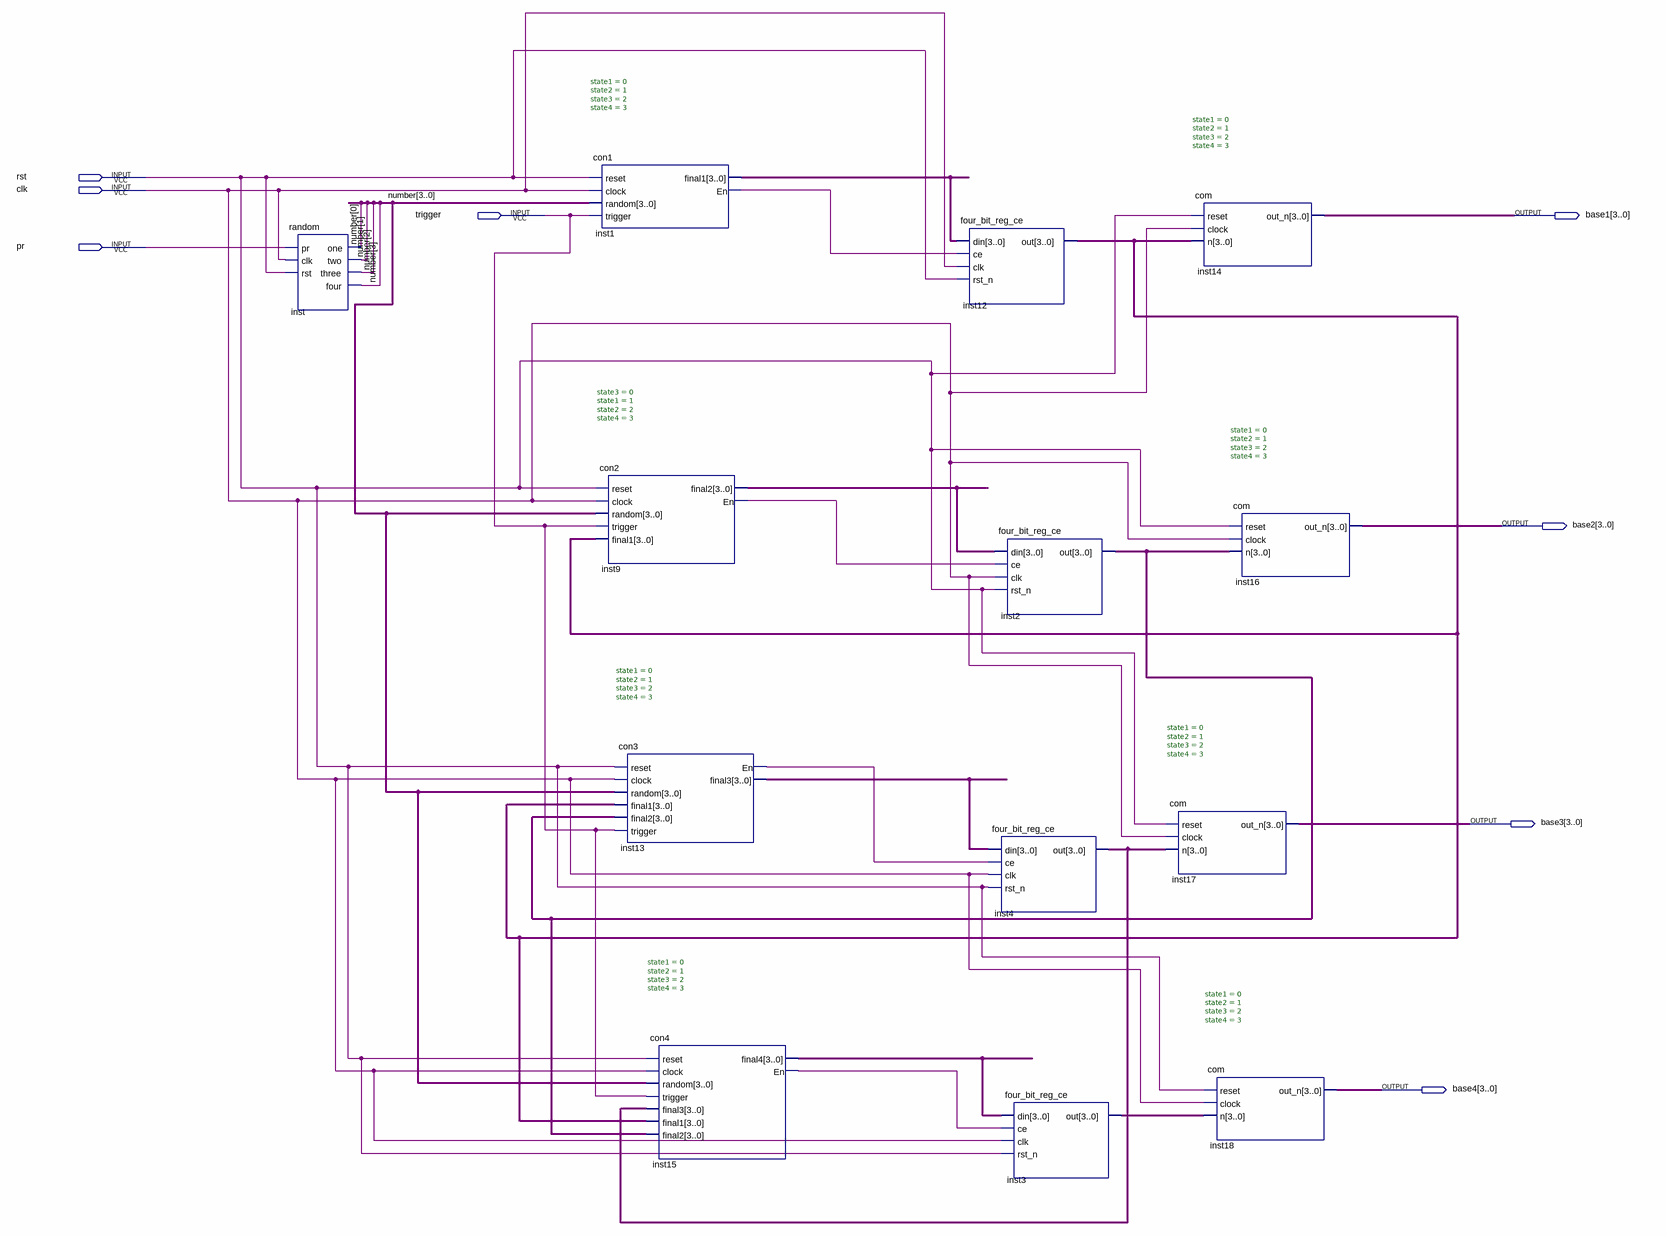
[diagram p0: schematic sheet]
// Quartus schematic test4.bdf as structural Verilog: 13 symbols, 8 pins
module test4 (
  input  rst,
  input  clk,
  input  trigger,
  input  pr,
  output [3:0] base1,
  output [3:0] base2,
  output [3:0] base3,
  output [3:0] base4
);

  wire inst1_en, inst9_en, inst13_en, inst15_en;
  wire [3:0] inst1_final1, inst2_out, inst3_out, inst4_out, inst9_final2, inst12_out, inst13_final3,
       inst15_final4, number;

  random inst (.pr(pr), .clk(clk), .rst(rst), .one(number[0]), .two(number[1]), .three(number[2]), .four(number[3]));
  con1 #(.state1(0), .state2(1), .state3(2), .state4(3)) inst1 (
    .reset(rst), .clock(clk), .random(number), .trigger(trigger), .final1(inst1_final1), .En(inst1_en));
  con2 #(.state3(0), .state1(1), .state2(2), .state4(3)) inst9 (
    .reset(rst), .clock(clk), .random(number), .trigger(trigger), .final1(inst12_out), .final2(inst9_final2),
    .En(inst9_en));
  con3 #(.state1(0), .state2(1), .state3(2), .state4(3)) inst13 (
    .reset(rst), .clock(clk), .random(number), .final1(inst12_out), .final2(inst2_out), .trigger(trigger),
    .En(inst13_en), .final3(inst13_final3));
  con4 #(.state1(0), .state2(1), .state3(2), .state4(3)) inst15 (
    .reset(rst), .clock(clk), .random(number), .trigger(trigger), .final3(inst4_out), .final1(inst12_out),
    .final2(inst2_out), .final4(inst15_final4), .En(inst15_en));
  four_bit_reg_ce inst12 (.din(inst1_final1), .ce(inst1_en), .clk(clk), .rst_n(rst), .out(inst12_out));
  four_bit_reg_ce inst2 (.din(inst9_final2), .ce(inst9_en), .clk(clk), .rst_n(rst), .out(inst2_out));
  four_bit_reg_ce inst4 (.din(inst13_final3), .ce(inst13_en), .clk(clk), .rst_n(rst), .out(inst4_out));
  four_bit_reg_ce inst3 (.din(inst15_final4), .ce(inst15_en), .clk(clk), .rst_n(rst), .out(inst3_out));
  com #(.state1(0), .state2(1), .state3(2), .state4(3)) inst14 (
    .reset(rst), .clock(clk), .n(inst12_out), .out_n(base1));
  com #(.state1(0), .state2(1), .state3(2), .state4(3)) inst17 (.reset(rst), .clock(clk), .n(inst4_out), .out_n(base3));
  com #(.state1(0), .state2(1), .state3(2), .state4(3)) inst18 (.reset(rst), .clock(clk), .n(inst3_out), .out_n(base4));
  com #(.state1(0), .state2(1), .state3(2), .state4(3)) inst16 (.reset(rst), .clock(clk), .n(inst2_out), .out_n(base2));
endmodule
